# EAGLE design LoadCell (EAGLE 7.6.0)
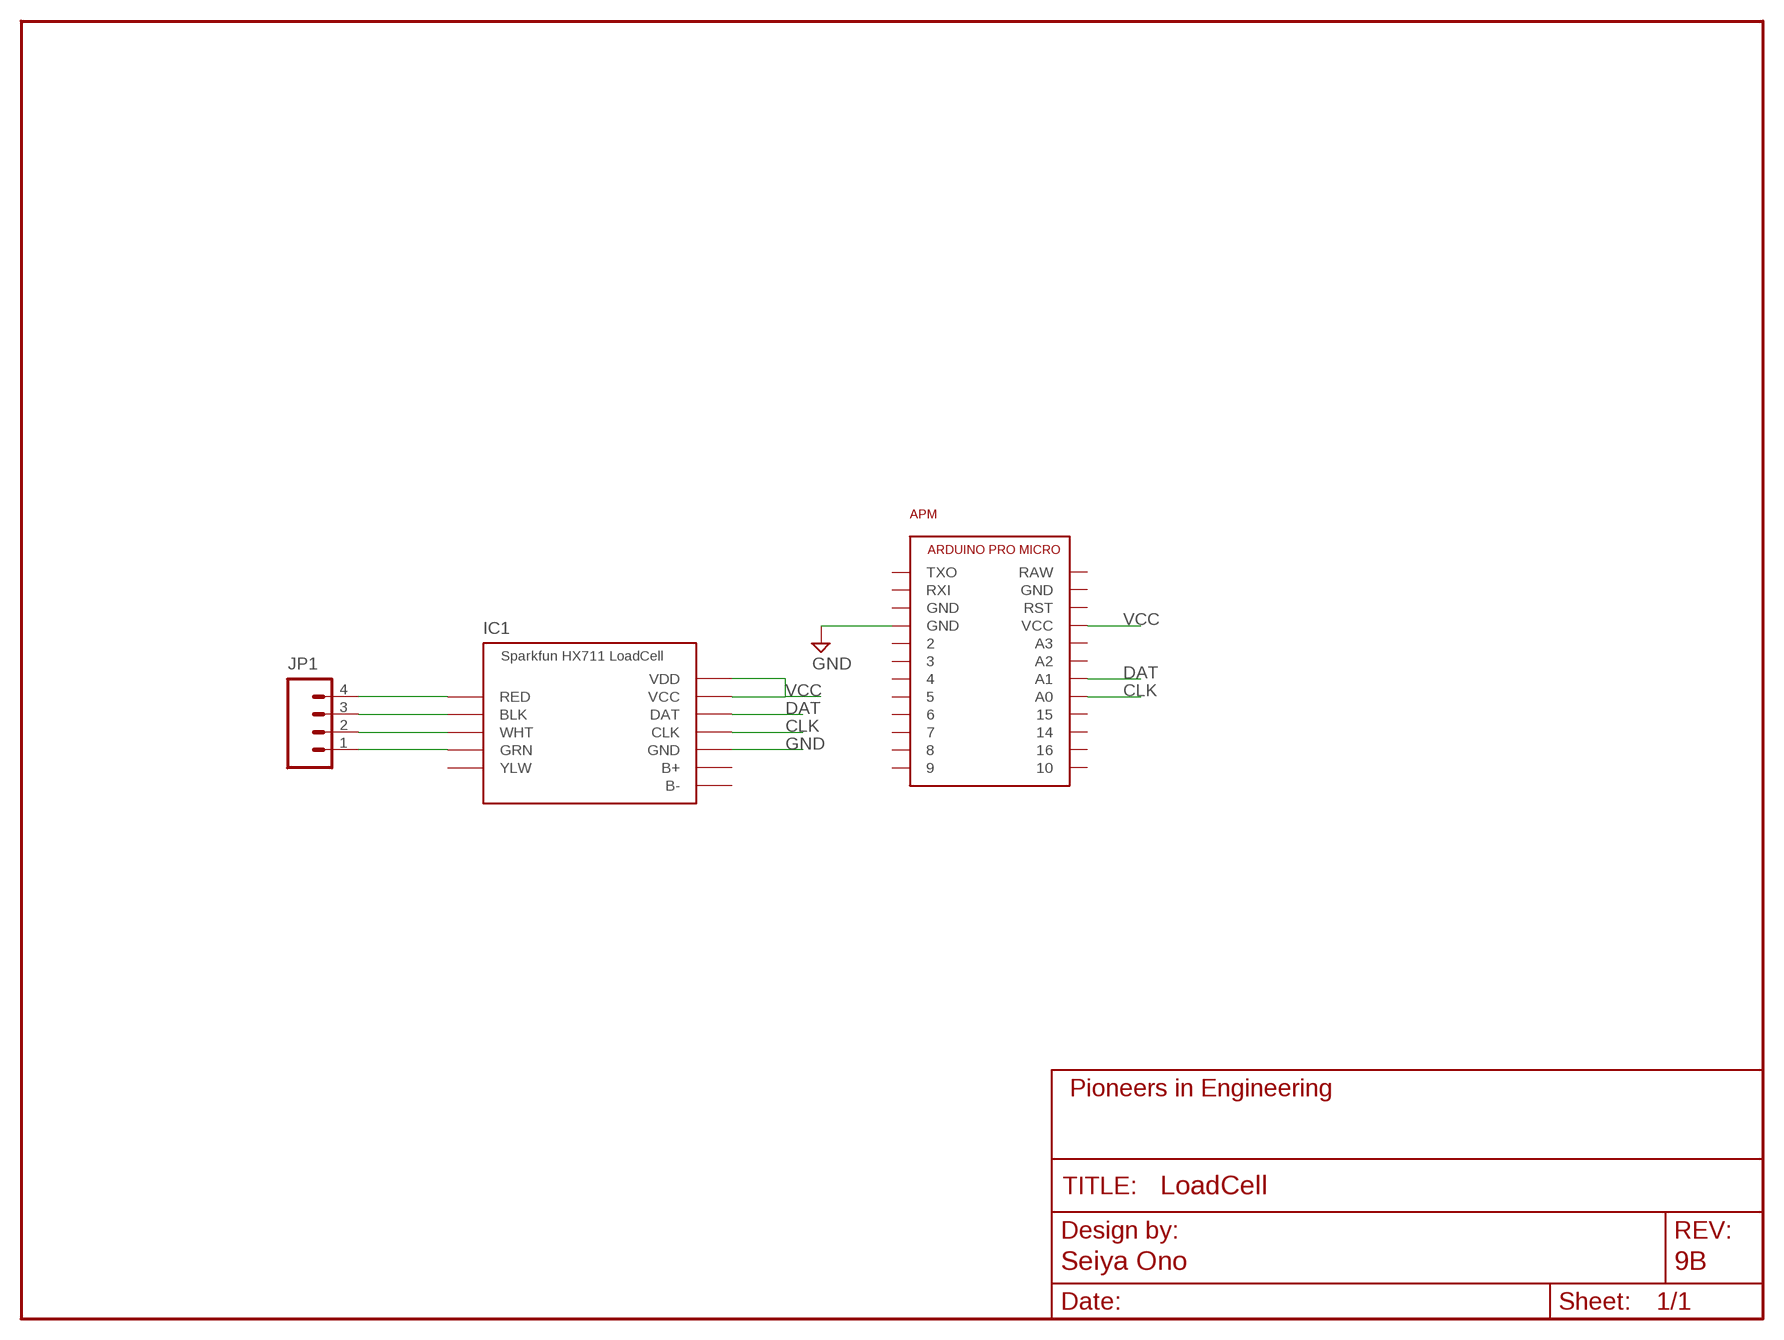
[diagram p0: schematic, sheet 1]
FRAME1 (FRAME_SCHEMATIC): AUTHOR: Seiya Ono; REVISION: 9B

## Parts
APM  ARDUINO_PRO_MICRO  [ARDUINO_PRO_MICRO]
IC1  LOADCELL_AMP  [LOADCELL_AMP]
JP1  M041X04-MTA  [1X04-MTA]

## Nets
CLK: APM.A0 IC1.CLK
DAT: APM.A1 IC1.DAT
GND: APM.GND@1(GND) IC1.GND
N$1: IC1.BLK JP1.3
N$2: IC1.RED JP1.4
N$3: IC1.WHT JP1.2
N$4: IC1.GRN JP1.1
VCC: APM.VCC IC1.VCC IC1.VDD
Unconnected: APM.2 APM.3 APM.4 APM.5 APM.6 APM.7 APM.8 APM.9 APM.10 APM.14 APM.15 APM.16 APM.A2 APM.A3 APM.GND@0(GND) APM.GND@2(GND) APM.RAW APM.RST APM.RXI APM.TXO IC1.B+ IC1.B- IC1.YLW

## Library data of the parts
APM = pie:ARDUINO_PRO_MICRO: Arduino Pro Micro Electrical System Year 9's Smart Sensor Core Pin Outs <https://cdn.sparkfun.com/assets/9/c/3/c/4/523a1765757b7f5c6e8b4567.png> Buy Here <http://www.aliexpress.com/item/Mini-Leonardo-Pro-Micro-ATmega32U4-5V-16MHz-Module-For-Arduino-Best-Quality/32284746884.html?ws_ab_test=searchweb201556_8,searchweb201602_2_10057_10056_10065_10055_10054_10067_10069_10059_10058_10017_10070_10060_10061_10052_10062_10053_10050_10051,searchweb201603_1&btsid=45993952-29ca-4de4-a0fb-c7fb72b8e1a5>
IC1 = pie:LOADCELL_AMP: Sparkfun HX711 Load Cell Amp
JP1 = pie:M04: 4-pin 0.1-inch header and MTA connector; PIE-INT-REF-NUM: MTA

## Board
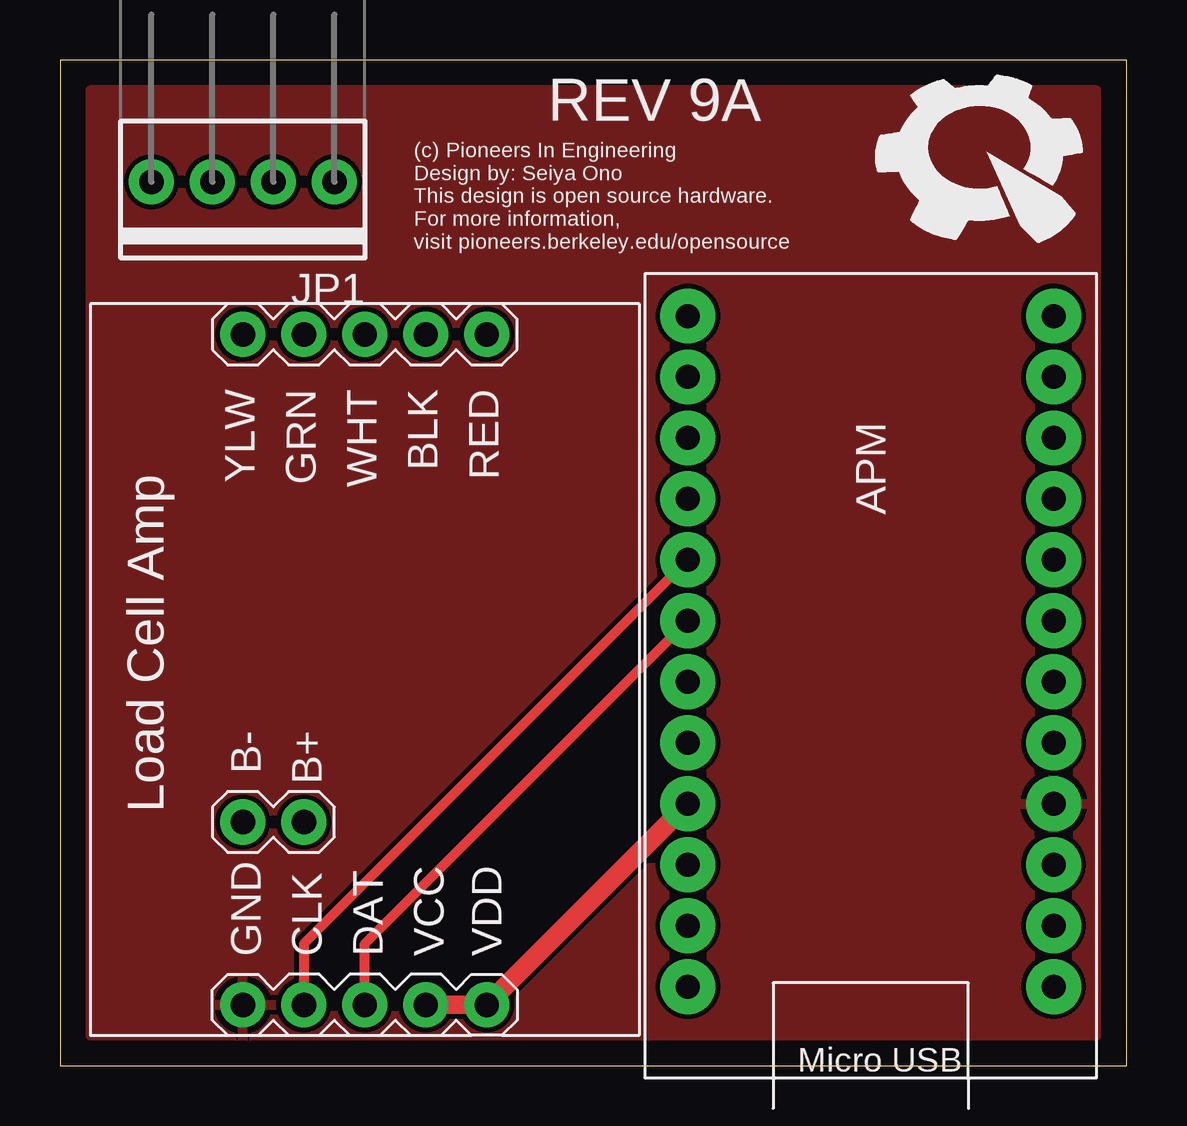
[diagram p1: board, top side]
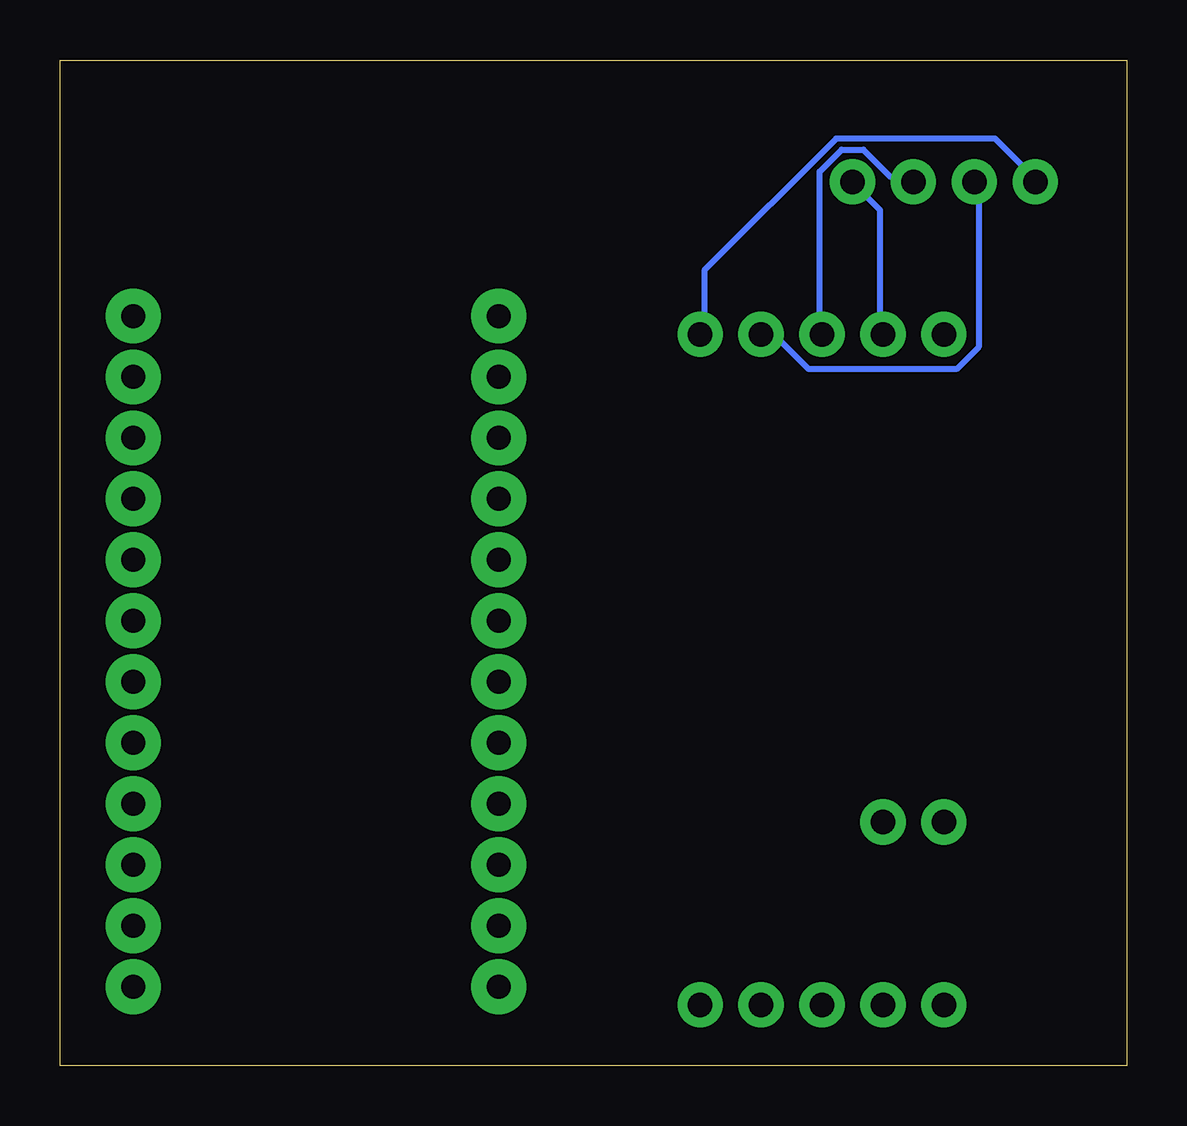
[diagram p2: board, bottom side, seen from below]

Size 44.45 x 41.91 mm. Coordinates in mm from the lower left corner, seen from the top.
Outline: 0,0 44.45,0 44.45,41.91 0,41.91 0,0
Copper layers (1*16): Top 0.035mm / dielectric 1.5mm / Bottom 0.035mm
Design rules "default": minimum track width 10mil, minimum drill 24mil, track to track 8mil, track to pad 8mil, pad to pad 8mil, via to via 8mil, smd to smd 8mil, copper to edge 40mil, drill to drill 8mil, minimum pad ring 10mil, minimum via ring 8mil, stop-mask expansion 4mil, vias tented up to drill 0mil, thermal gap 10mil

### Footprints (pad centres in the part's own frame; a part is rotated, then mirrored left to right if it is on the bottom)
ARDUINO_PRO_MICRO = drill 1 pad 2.286: 2 1.778,19.558; 3 1.778,17.018; 4 1.778,14.478; 5 1.778,11.938; 6 1.778,9.398; 7 1.778,6.858; 8 1.778,4.318; 9 1.778,1.778; 10 17.018,1.778; 14 17.018,6.858; 15 17.018,9.398; 16 17.018,4.318; A0 17.018,11.938; A1 17.018,14.478; A2 17.018,17.018; A3 17.018,19.558; GND@0 1.778,24.638; GND@1 1.778,22.098; GND@2 17.018,27.178; RAW 17.018,29.718; RST 17.018,24.638; RXI 1.778,27.178; TXO 1.778,29.718; VCC 17.018,22.098
LOADCELL_AMP = drill 1.016 pad 1.88: B+ 21.59,8.89; B- 21.59,6.35; BLK 1.27,13.97; CLK 29.21,8.89; DAT 29.21,11.43; GND 29.21,6.35; GRN 1.27,8.89; RED 1.27,16.51; VCC 29.21,13.97; VDD 29.21,16.51; WHT 1.27,11.43; YLW 1.27,6.35
1X04-MTA = drill 1.016 pad 1.88: 1 -3.81,0; 2 -1.27,0; 3 1.27,0; 4 3.81,0

### Placement (x,y rotation side)
APM  43.18,33.02 180 top
IC1  1.27,31.75 270 top
JP1  7.62,36.83 180 top
U$3  [PIE-LOGO-SMALL]  38.61,38.1 0 top

### Tracks (layer width: path | path; a pad name or v marks a point on that pad's centre or on a via)
CLK
  Top 0.406: APM.A0 10.16,5.08 IC1.CLK
DAT
  Top 0.406: IC1.DAT 12.7,5.08 APM.A1
GND
  pour Top: 1.27,1.27 43.18,1.27 43.18,40.64 1.27,40.64
N$1
  Bottom 0.254: IC1.BLK 15.09,30.4 14.63,30.4 13.26,29.03 7.09,29.03 6.17,29.95 6.17,36.8 JP1.3
N$2
  Bottom 0.254: IC1.RED 17.6,30.63 17.6,33.15 12.12,38.63 5.49,38.63 3.89,37.03 JP1.4
N$3
  Bottom 0.254: JP1.2 8.91,37.03 9.83,37.03 10.97,38.18 11.89,38.18 12.8,37.26 12.8,30.63 IC1.WHT
N$4
  Bottom 0.254: IC1.GRN 10.29,30.63 10.29,35.66 11.43,36.8 JP1.1
VCC
  Top 0.762: APM.VCC IC1.VDD IC1.VCC

### Text on the board
tPlace: (c) Pioneers In Engineering / Design by: Seiya Ono / This design is open source hardware. / For more information, / visit pioneers.berkeley.edu/opensource
tNames: REV 9A